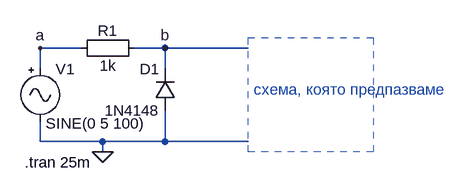
[diagram p0: schematic clipper_diod_neg.asc]
clipper_diod_neg.asc, the LTspice schematic file:
Version 4
SHEET 1 880 680
WIRE 16 192 -48 192
WIRE 144 192 96 192
WIRE 272 192 144 192
WIRE -48 224 -48 192
WIRE 144 224 144 192
WIRE -48 336 -48 304
WIRE 48 336 -48 336
WIRE 144 336 144 288
WIRE 144 336 48 336
WIRE 272 336 144 336
WIRE 48 352 48 336
FLAG 144 192 b
FLAG 48 352 0
FLAG -48 192 a
SYMBOL diode 160 288 R180
WINDOW 0 24 64 Left 2
WINDOW 3 24 0 Left 2
SYMATTR InstName D1
SYMATTR Value 1N4148
SYMBOL Misc\\signal -48 208 R0
WINDOW 123 0 0 Left 2
WINDOW 39 0 0 Left 2
WINDOW 3 8 100 Left 2
SYMATTR Value SINE(0 5 100)
SYMATTR InstName V1
SYMBOL Misc\\EuropeanResistor 112 176 R90
WINDOW 0 5 56 VBottom 2
WINDOW 3 27 56 VTop 2
SYMATTR InstName R1
SYMATTR Value 1k
TEXT -72 368 Left 2 !.tran 25m
TEXT 280 256 Left 2 ;схема, която предпазваме
RECTANGLE Normal 464 352 272 176 2

The netlist it stands for:
* clipper_diod_neg.asc
D1 0 b 1N4148
V1 a 0 SINE(0 5 100)
R1 b a 1k
.model D D
.lib standard.dio
.tran 25m
* схема, която предпазваме
.backanno
.end